# EAGLE schematic bc-module-co2 (EAGLE 7.7.0)

## Sheet 1 of 2
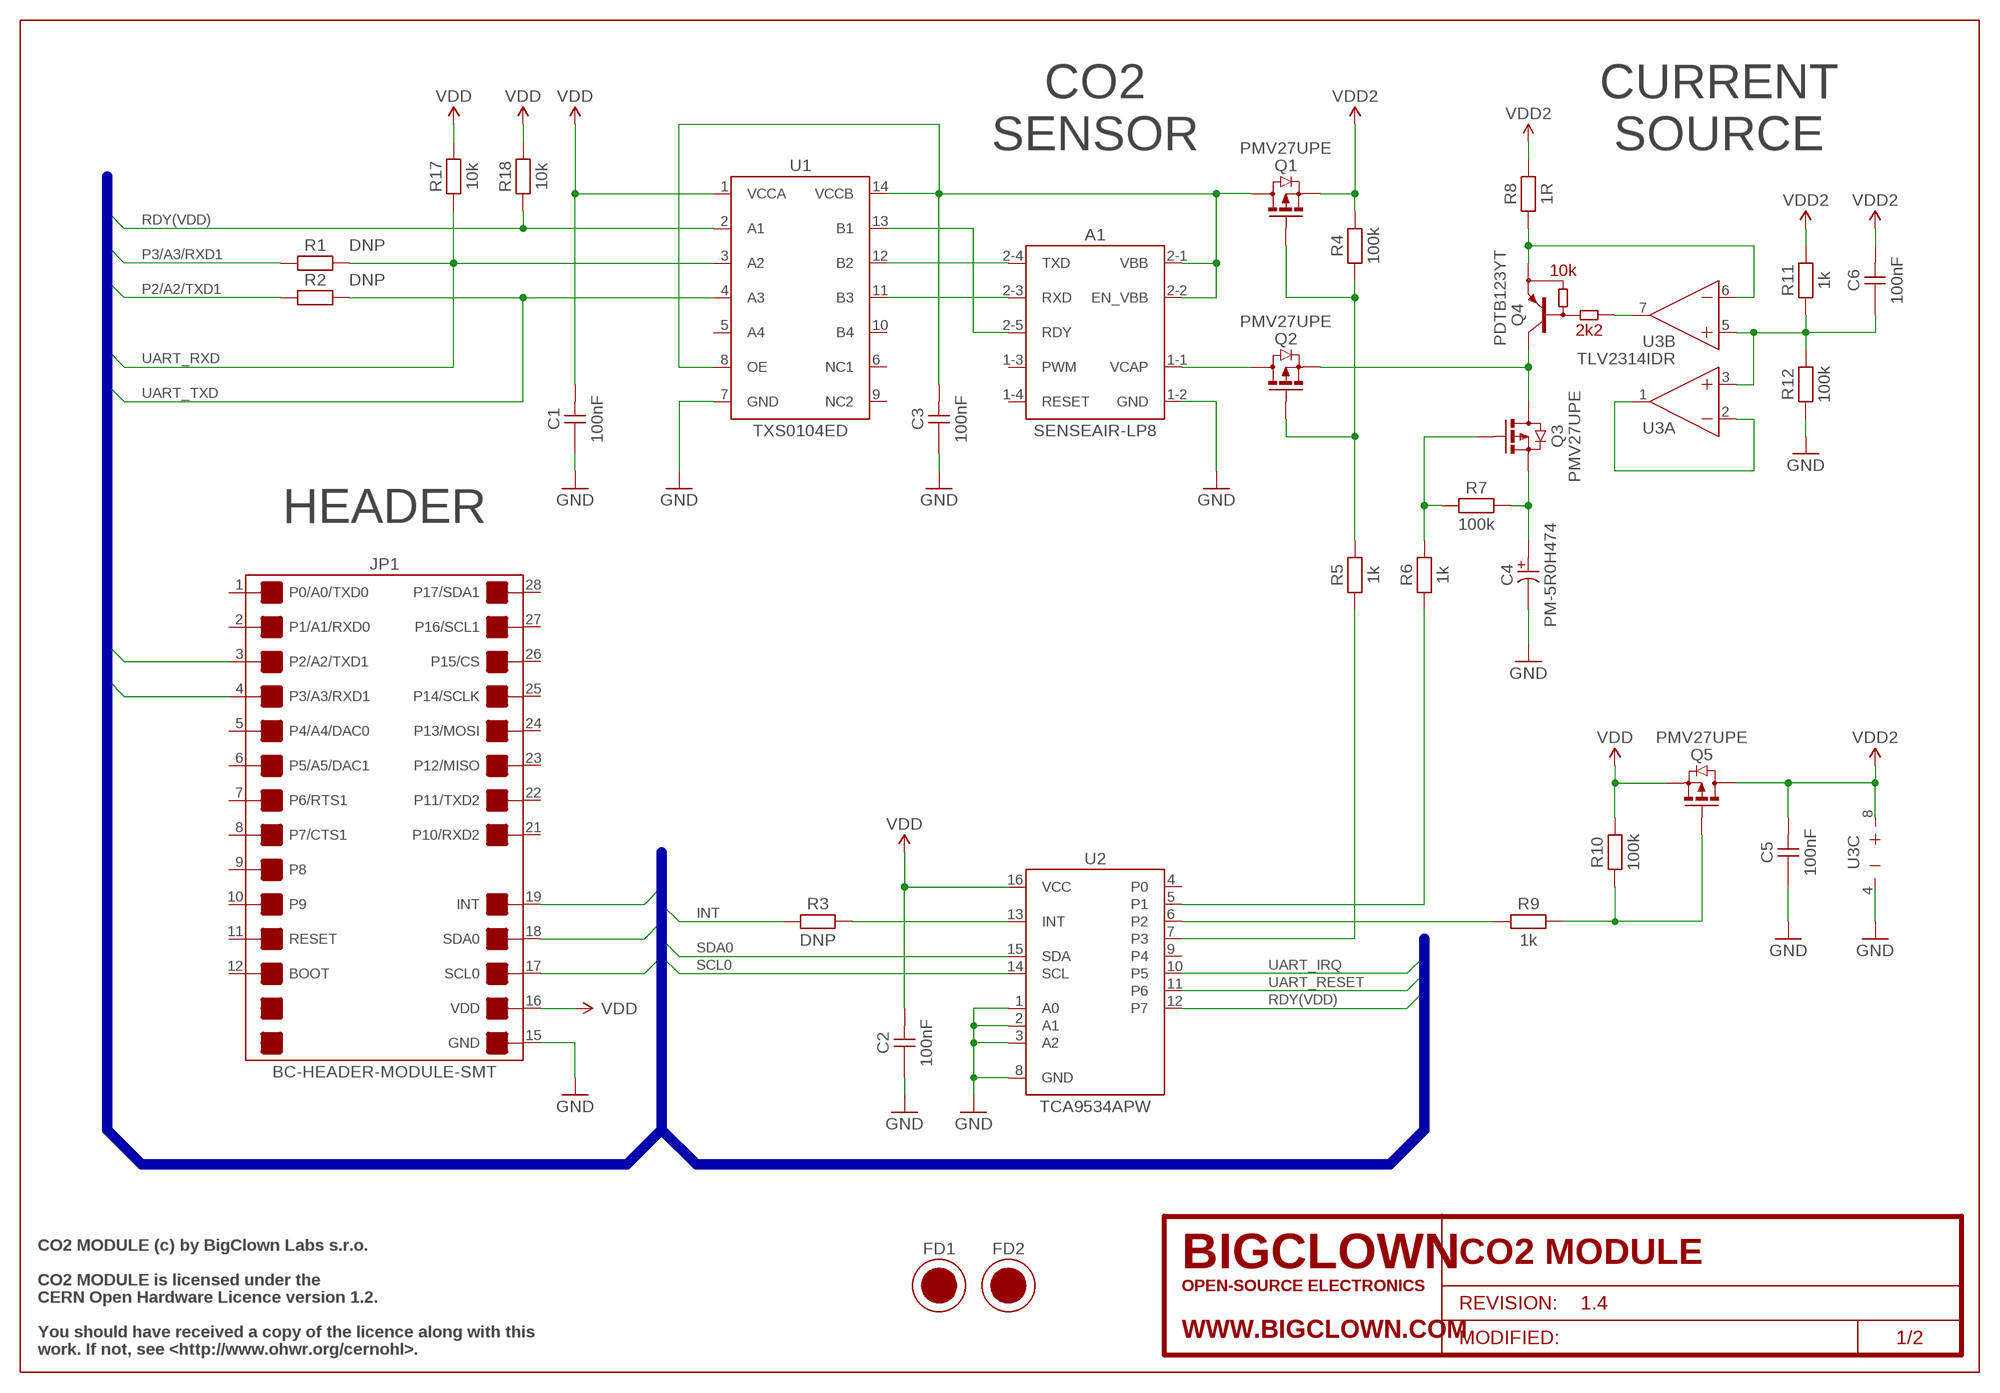
[diagram p0: schematic, sheet 1]

### Parts
A1  SENSEAIR-LP8  U-SENSEAIR-LP8  [SENSEAIR-LP8_T]
C1  100nF  C-0805-100NF  [CAPACITOR-0805_R]
C2  100nF  C-0805-100NF  [CAPACITOR-0805_R]
C3  100nF  C-0805-100NF  [CAPACITOR-0805_R]
C4  PM-5R0H474  C-PM-5R0H474  [PM-5R0H474_T]
C5  100nF  C-0805-100NF  [CAPACITOR-0805_R]
C6  100nF  C-0805-100NF  [CAPACITOR-0805_R]
FD1  FIDUCIAL  [FIDUCIAL-1MM]
FD2  FIDUCIAL  [FIDUCIAL-1MM]
FRAME1  FRAME-SCH/A4L-BRD/A4L  [FRAME-A4L]
JP1  BC-HEADER-MODULE-SMT  [BC-HEADER-MODULE-SMT]
Q1  PMV27UPE  Q-PMV27UPE  [SOT-23_R]
Q2  PMV27UPE  Q-PMV27UPE  [SOT-23_R]
Q3  PMV27UPE  Q-PMV27UPE  [SOT-23_R]
Q4  PDTB123YT  Q-PDTB123YT  [SOT-23_R]
Q5  PMV27UPE  Q-PMV27UPE  [SOT-23_R]
R1  DNP  R-0805-DNP  [RESISTOR-0805_R]
R2  DNP  R-0805-DNP  [RESISTOR-0805_R]
R3  DNP  R-0805-DNP  [RESISTOR-0805_R]
R4  100k  R-0805-100K  [RESISTOR-0805_R]
R5  1k  R-0805-1K  [RESISTOR-0805_R]
R6  1k  R-0805-1K  [RESISTOR-0805_R]
R7  100k  R-0805-100K  [RESISTOR-0805_R]
R8  1R  R-0805-1R  [RESISTOR-0805_R]
R9  1k  R-0805-1K  [RESISTOR-0805_R]
R10  100k  R-0805-100K  [RESISTOR-0805_R]
R11  1k  R-0805-1K  [RESISTOR-0805_R]
R12  100k  R-0805-100K  [RESISTOR-0805_R]
R17  10k  R-0805-10K  [RESISTOR-0805_R]
R18  10k  R-0805-10K  [RESISTOR-0805_R]
U1  TXS0104ED  U-TXS0104ED  [TXS0104ED_R]
U2  TCA9534APW  U-TCA9534APW  [TCA9534APW_R]
U3  TLV2314IDR  U-TLV2314IDR  [TLV2314IDR_R]

### Nets
CAP_ON: R6.1 U2.5(P1)
CAP_ON_G: Q3.1(G) R6.2 R7.1
CAP_P: C4.A Q3.2(S) R7.2
CAP_SWITCHED: Q2.2(S) Q3.3(D) Q4.3(C)
GND: A1.1-2(GND) C1.2 C2.2 C3.2 C4.C C5.2 JP1.15(GND) R12.1 U1.7(GND) U2.1(A0) U2.2(A1) U2.3(A2) U2.8(GND) U3.4(C:V-) ; also sheet 2
INT: JP1.19(INT) R3.1 ; also sheet 2
INT_EXPANDER: R3.2 U2.13(INT)
LP8_ON: R5.1 U2.7(P3)
LP8_ON_G: Q1.1(G) Q2.1(G) R4.1 R5.2
OPAMP_FB: Q4.2(E) R8.1 U3.6(B:IN-)
OPAMP_FB_DUMMY: U3.1(A:OUT) U3.2(A:IN-)
OPAMP_OUT: Q4.1(B) U3.7(B:OUT)
OPAMP_VREF: C6.2 R11.1 R12.2 U3.3(A:IN+) U3.5(B:IN+)
P2/A2/TXD1: JP1.3(P2/A2/TXD1) R2.1
P3/A3/RXD1: JP1.4(P3/A3/RXD1) R1.1
RDY(VDD2): A1.2-5(RDY) U1.13(B1)
RDY(VDD): R18.1 U1.2(A1) U2.12(P7)
RXD(VDD2): A1.2-3(RXD) U1.11(B3)
SCL0: JP1.17(SCL0) U2.14(SCL) ; also sheet 2
SDA0: JP1.18(SDA0) U2.15(SDA) ; also sheet 2
TXD(VDD2): A1.2-4(TXD) U1.12(B2)
UART_IRQ: U2.10(P5) ; also sheet 2
UART_RESET: U2.11(P6) ; also sheet 2
UART_RXD: R1.2 R17.1 U1.3(A2) ; also sheet 2
UART_TXD: R2.2 U1.4(A3) ; also sheet 2
VBB: A1.2-1(VBB) A1.2-2(EN_VBB) C3.1 Q1.3(D) U1.8(OE) U1.14(VCCB)
VCAP: A1.1-1(VCAP) Q2.3(D)
VDD: C1.1 C2.1 JP1.16(VDD) Q5.2(S) R10.2 R17.2 R18.2 U1.1(VCCA) U2.16(VCC) ; also sheet 2
VDD2: C5.1 C6.1 Q1.2(S) Q5.3(D) R4.2 R8.2 R11.2 U3.8(C:V+)
VDD2_ON: R9.1 U2.6(P2)
VDD2_ON_G: Q5.1(G) R9.2 R10.1
Unconnected: A1.1-3(PWM) A1.1-4(RESET) JP1.1(P0/A0/TXD0) JP1.2(P1/A1/RXD0) JP1.5(P4/A4/DAC0) JP1.6(P5/A5/DAC1) JP1.7(P6/RTS1) JP1.8(P7/CTS1) JP1.9(P8) JP1.10(P9) JP1.11(RESET) JP1.12(BOOT) JP1.21(P10/RXD2) JP1.22(P11/TXD2) JP1.23(P12/MISO) JP1.24(P13/MOSI) JP1.25(P14/SCLK) JP1.26(P15/CS) JP1.27(P16/SCL1) JP1.28(P17/SDA1) U1.5(A4) U1.6(NC1) U1.9(NC2) U1.10(B4) U2.4(P0) U2.9(P4)

### Buses
INT,SDA0,SCL0,P2/A2/TXD1,P3/A3/RXD1,UART_TXD,UART_RXD,UART_IRQ,UART_RESET,RDY(VDD)

### Notes on the sheet
- CO2
  SENSOR
- CURRENT
  SOURCE
- 10k
- 2k2
- HEADER
- CO2 MODULE (c) by BigClown Labs s.r.o.
- CO2 MODULE is licensed under the
- CERN Open Hardware Licence version 1.2.
- You should have received a copy of the licence along with this
- work. If not, see <http://www.ohwr.org/cernohl>.

## Sheet 2 of 2
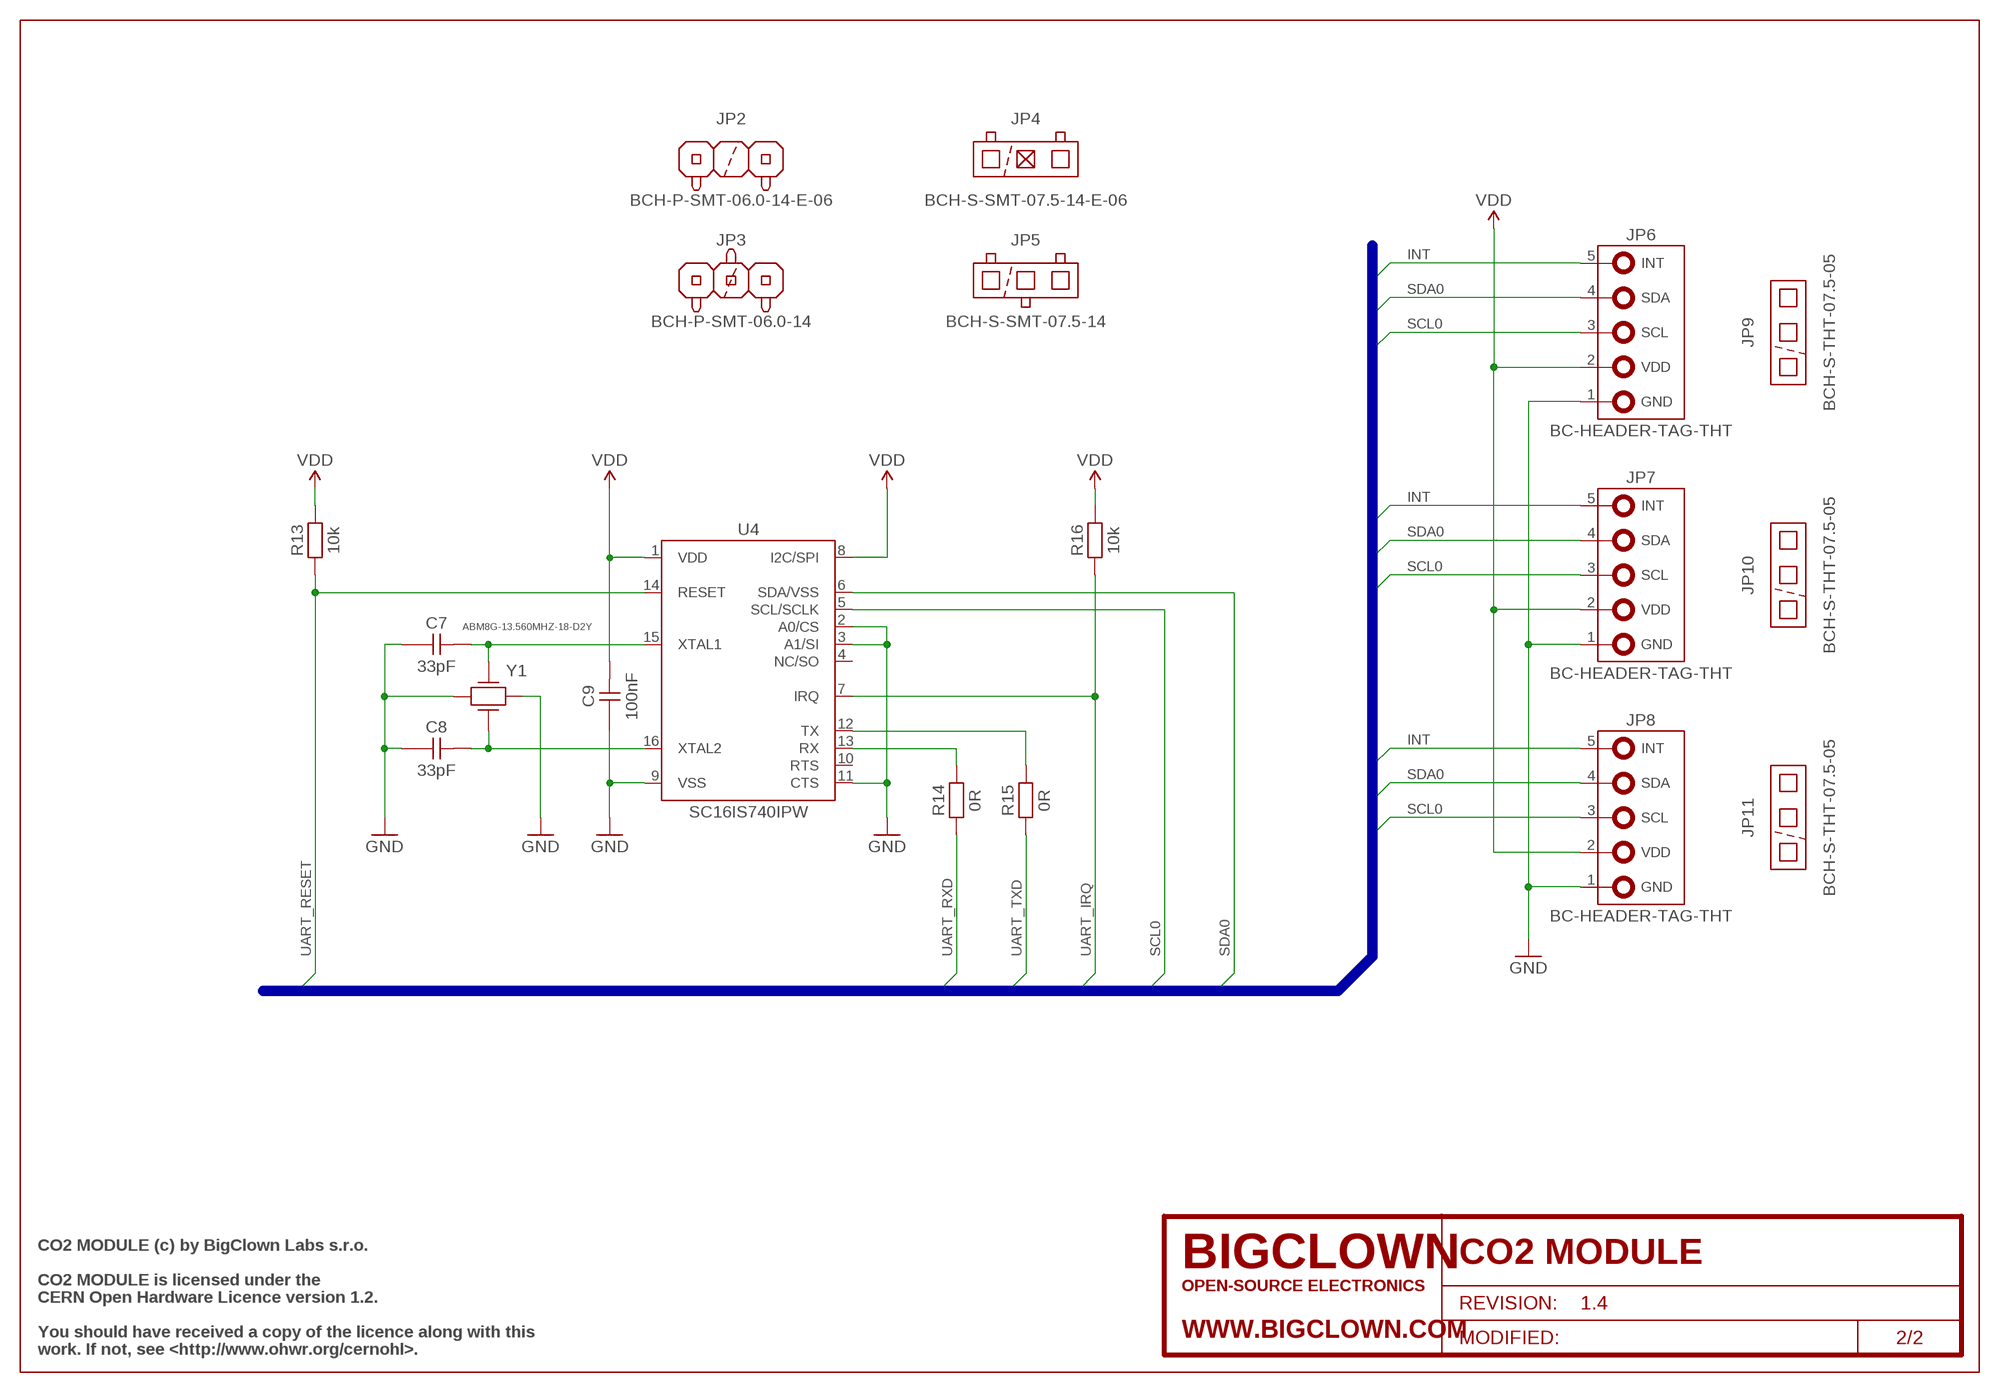
[diagram p1: schematic, sheet 2]
FRAME2 (FRAME-SCH/A4L-BRD/NONE): BCPN: -; PROJECT_NAME: CO2 MODULE; PROJECT_REVISION: 1.4

### Parts
C7  33pF  C-0805-33PF  [CAPACITOR-0805_R]
C8  33pF  C-0805-33PF  [CAPACITOR-0805_R]
C9  100nF  C-0805-100NF  [CAPACITOR-0805_R]
JP2  BCH-P-SMT-06.0-14-E-06  JP-BCH-P-SMT-06.0-14-E-06  [BCH-P-SMT-14-E-06]
JP3  BCH-P-SMT-06.0-14  JP-BCH-P-SMT-06.0-14  [BCH-P-SMT-14]
JP4  BCH-S-SMT-07.5-14-E-06  JP-BCH-S-SMT-07.5-14-E-06  [BCH-S-SMT-14-E-06]
JP5  BCH-S-SMT-07.5-14  JP-BCH-S-SMT-07.5-14  [BCH-S-SMT-14]
JP6  BC-HEADER-TAG-THT  [BC-HEADER-TAG-THT]
JP7  BC-HEADER-TAG-THT  [BC-HEADER-TAG-THT]
JP8  BC-HEADER-TAG-THT  [BC-HEADER-TAG-THT]
JP9  BCH-S-THT-07.5-05  JP-BCH-S-THT-07.5-05  [BCH-S-THT-05]
JP10  BCH-S-THT-07.5-05  JP-BCH-S-THT-07.5-05  [BCH-S-THT-05]
JP11  BCH-S-THT-07.5-05  JP-BCH-S-THT-07.5-05  [BCH-S-THT-05]
R13  10k  R-0805-10K  [RESISTOR-0805_R]
R14  0R  R-0805-0R  [RESISTOR-0805_R]
R15  0R  R-0805-0R  [RESISTOR-0805_R]
R16  10k  R-0805-10K  [RESISTOR-0805_R]
U4  SC16IS740IPW  U-SC16IS740IPW  [SC16IS740IPW_R]
Y1  ABM8G-13.560MHZ-18-D2Y  Y-ABM8G-13.560MHZ-18-D2Y  [ABM8G-13.560MHZ-18-D2Y_R]

### Nets
GND: C7.2 C8.2 C9.2 JP6.1(GND) JP7.1(GND) JP8.1(GND) U4.2(A0/CS) U4.3(A1/SI) U4.9(VSS) U4.11(CTS) Y1.2(GND1) Y1.4(GND2) ; also sheet 1
INT: JP6.5(INT) JP7.5(INT) JP8.5(INT) ; also sheet 1
RX: R14.2 U4.13(RX)
SCL0: JP6.3(SCL) JP7.3(SCL) JP8.3(SCL) U4.5(SCL/SCLK) ; also sheet 1
SDA0: JP6.4(SDA) JP7.4(SDA) JP8.4(SDA) U4.6(SDA/VSS) ; also sheet 1
TX: R15.2 U4.12(TX)
UART_IRQ: R16.1 U4.7(IRQ) ; also sheet 1
UART_RESET: R13.1 U4.14(RESET) ; also sheet 1
UART_RXD: R14.1 ; also sheet 1
UART_TXD: R15.1 ; also sheet 1
VDD: C9.1 JP6.2(VDD) JP7.2(VDD) JP8.2(VDD) R13.2 R16.2 U4.1(VDD) U4.8(I2C/SPI) ; also sheet 1
XTAL1: C7.1 U4.15(XTAL1) Y1.1(Y1)
XTAL2: C8.1 U4.16(XTAL2) Y1.3(Y2)
Unconnected: U4.4(NC/SO) U4.10(RTS)

### Buses
INT,SDA0,SCL0,P2/A2/TXD1,P3/A3/RXD1,UART_TXD,UART_RXD,UART_IRQ,UART_RESET

### Notes on the sheet
- CO2 MODULE (c) by BigClown Labs s.r.o.
- CO2 MODULE is licensed under the
- CERN Open Hardware Licence version 1.2.
- You should have received a copy of the licence along with this
- work. If not, see <http://www.ohwr.org/cernohl>.

## Library data of the parts
A1 = bc-sensor:U-SENSEAIR-LP8; BCPN: BC-U-SENSEAIR-LP8
C1-C3 C5 C6 C9 = bc-capacitor:C-0805-100NF; BCPN: BC-C-0805-100NF
C4 = bc-capacitor:C-PM-5R0H474; BCPN: BC-C-PM-5R0H474
C7 C8 = bc-capacitor:C-0805-33PF; BCPN: BC-C-0805-33PF
FD1 FD2 = bc-fiducial:FIDUCIAL; BCPN: -
FRAME1 = bc-frame:FRAME-SCH/A4L-BRD/A4L; BCPN: -; PROJECT_NAME: CO2 MODULE; PROJECT_REVISION: 1.4
JP1 = bc-header:BC-HEADER-MODULE-SMT; BCPN: -
JP2 = bc-header:JP-BCH-P-SMT-06.0-14-E-06; BCPN: BC-JP-BCH-P-SMT-06.0-14-E-06
JP3 = bc-header:JP-BCH-P-SMT-06.0-14; BCPN: BC-JP-BCH-P-SMT-06.0-14
JP4 = bc-header:JP-BCH-S-SMT-07.5-14-E-06; BCPN: BC-JP-BCH-S-SMT-07.5-14-E-06
JP5 = bc-header:JP-BCH-S-SMT-07.5-14; BCPN: BC-JP-BCH-S-SMT-07.5-14
JP6-JP8 = bc-header:BC-HEADER-TAG-THT; BCPN: -
JP9-JP11 = bc-header:JP-BCH-S-THT-07.5-05; BCPN: BC-JP-BCH-S-THT-07.5-05
Q1-Q3 Q5 = bc-discrete:Q-PMV27UPE; BCPN: BC-Q-PMV27UPE
Q4 = bc-discrete:Q-PDTB123YT; BCPN: BC-Q-PDTB123YT
R1-R3 = bc-resistor:R-0805-DNP; BCPN: -
R4 R7 R10 R12 = bc-resistor:R-0805-100K; BCPN: BC-R-0805-100K
R5 R6 R9 R11 = bc-resistor:R-0805-1K; BCPN: BC-R-0805-1K
R8 = bc-resistor:R-0805-1R; BCPN: BC-R-0805-1R
R13 R16-R18 = bc-resistor:R-0805-10K; BCPN: BC-R-0805-10K
R14 R15 = bc-resistor:R-0805-0R; BCPN: BC-R-0805-0R
U1 = bc-interface:U-TXS0104ED; BCPN: BC-U-TXS0104ED
U2 = bc-interface:U-TCA9534APW; BCPN: BC-U-TCA9534APW
U3 = bc-linear:U-TLV2314IDR; BCPN: BC-U-TLV2314IDR
U4 = bc-interface:U-SC16IS740IPW; BCPN: BC-U-SC16IS740IPW
Y1 = bc-crystal:Y-ABM8G-13.560MHZ-18-D2Y; BCPN: BC-Y-ABM8G-13.560MHZ-18-D2Y